# Altium schematic sheet control_module.SchDoc
size A4
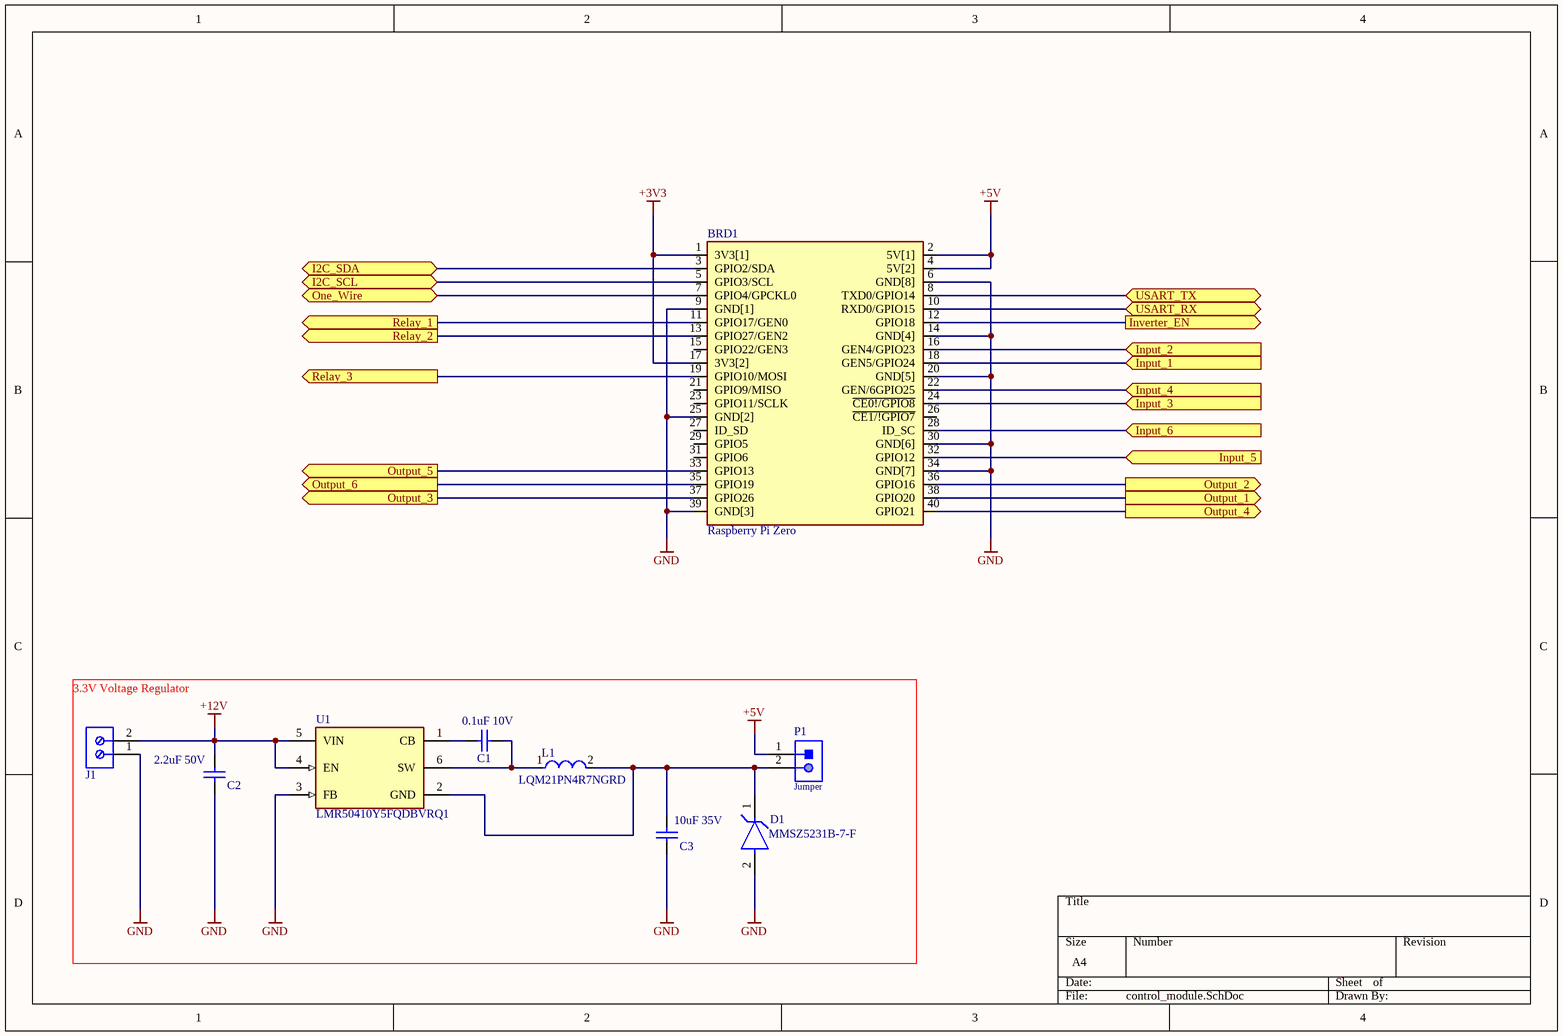
[diagram p0: control_module.SchDoc]

## Parts
BRD1  Raspberry Pi Zero  [RASPBERRY_PI_ZERO]
C1  0.1uF 10V  [CAPC2013X88X50ML20T25]
C2  2.2uF 50V  [CAPC2013X88X50ML20T25]
C3  10uF 35V  [CAPC2013X88X50ML20T25]
D1  MMSZ5231B-7-F  [FP-SOD123-MFG]
J1  282836-2  [TECO-282836-2_V]  (value not drawn)
L1  LQM21PN4R7NGRD  [FP-LQM21PH_G0-IPC_B]
P1  Jumper  [61300211121]
U1  LMR50410Y5FQDBVRQ1  [FP-DBV0006A-IPC_C]

## Ports
I2C_SCL (bidir), I2C_SDA (bidir), Input_1 (in), Input_2 (in), Input_3 (in), Input_4 (in), Input_5 (in), Input_6 (in), Inverter_EN (out), One_Wire (bidir), Output_1 (out), Output_2 (out), Output_3 (out), Output_4 (out), Output_5 (out), Output_6 (out), Relay_1 (out), Relay_2 (out), Relay_3 (out), USART_RX (bidir), USART_TX (bidir)

## Nets
+3V3: BRD1.1(3V3[1]) BRD1.17(3V3[2])
+5V: BRD1.2(5V[1]) BRD1.4(5V[2]) P1.1
+12V: C2.2 J1.2 U1.4(EN) U1.5(VIN)
GND: BRD1.6(GND[8]) BRD1.9(GND[1]) BRD1.14(GND[4]) BRD1.20(GND[5]) BRD1.25(GND[2]) BRD1.30(GND[6]) BRD1.34(GND[7]) BRD1.39(GND[3]) C2.1 C3.2 D1.2(A) J1.1 U1.3(FB)
I2C_SCL: BRD1.5(GPIO3/SCL) ; port I2C_SCL
I2C_SDA: BRD1.3(GPIO2/SDA) ; port I2C_SDA
Input_1: BRD1.18(GEN5/GPIO24) ; port Input_1
Input_2: BRD1.16(GEN4/GPIO23) ; port Input_2
Input_3: BRD1.24(~{CE0!/GPIO8}) ; port Input_3
Input_4: BRD1.22(GEN/6GPIO25) ; port Input_4
Input_5: BRD1.32(GPIO12) ; port Input_5
Input_6: BRD1.28(ID_SC) ; port Input_6
Inverter_EN: BRD1.12(GPIO18) ; port Inverter_EN
One_Wire: BRD1.7(GPIO4/GPCKL0) ; port One_Wire
Output_1: BRD1.38(GPIO20) ; port Output_1
Output_2: BRD1.36(GPIO16) ; port Output_2
Output_3: BRD1.37(GPIO26) ; port Output_3
Output_4: BRD1.40(GPIO21) ; port Output_4
Output_5: BRD1.33(GPIO13) ; port Output_5
Output_6: BRD1.35(GPIO19) ; port Output_6
Relay_1: BRD1.11(GPIO17/GEN0) ; port Relay_1
Relay_2: BRD1.13(GPIO27/GEN2) ; port Relay_2
Relay_3: BRD1.19(GPIO10/MOSI) ; port Relay_3
USART_RX: BRD1.10(RXD0/GPIO15) ; port USART_RX
USART_TX: BRD1.8(TXD0/GPIO14) ; port USART_TX
NetC1_1: C1.1 L1.1 U1.6(SW)
NetC1_2: C1.2 U1.1(CB)
NetC3_1: C3.1 D1.1(C) L1.2 P1.2 U1.2(GND)

Not connected (* = marked no-connect by the designer): BRD1 15(GPIO22/GEN3) 21(GPIO9/MISO) 23(GPIO11/SCLK) 26(~{CE1/!GPIO7}) 27(ID_SD) 29(GPIO5) 31(GPIO6)

## Notes on the sheet
- 3.3V Voltage Regulator

## Library data of the parts
BRD1 = MCU_raspberryPi_zero: Raspberry Pi Zero with Header; MP: ADA3708; Availability: Unavailable; Package: None; MF: Raspberry Pi; Value: *; Price: None; SnapEDA_Link: https://www.snapeda.com/parts/ADA3708/Raspberry%20Pi/view-part/2770118/?ref=snap
C1-C3 = Cap_0805: Capacitor
D1 = CMP-12792-000005-1: DIODE ZENER 5.1V 500MW SOD123; Manufacturer: Diodes; Standoff Height: 0mm; Max Zener Voltage: 5.36V; Max Reverse Leakage Current: 5uA; Max Junction Temp: +150°C; Power Dissipation: 370mW; Zener Impedance: 17Ω; Temperature: -65°C to +150°C; RoHS: TRUE; ComponentLink2Description: Datasheet; Octopart: https://octopart.com/mmsz5231b-7-f-diodes+inc.-55400050; Height: 1.45mm; ComponentLink2URL: https://www.diodes.com/assets/Datasheets/ds18010.pdf; Footprint Url: https://www.diodes.com/assets/Package-Files/SOD123.pdf; Device Class L2: Diodes; Nom Zener Voltage: 5.1V; Temperature Range Low: -65°C; Mouser Description: Zener Diodes 5.1V 500mW; Manufacturer Part Number: MMSZ5231B-7-F; Digikey Description: DIODE ZENER 5.1V 500MW SOD123; Device Class L1: Discrete Semiconductors; Device Class L3: Zener Diodes; Lead Free: Yes; Category: Diode; Automotive: No; Package: SOD123; Temperature Range High: +150°C
J1 = CMP-1684-00017-1: Female Header, Pitch 5 mm, 1 x 2 Position, Height 10 mm, Tail Length 3.5 mm, Rohs, Bulk; Manufacturer: TE Connectivity; Wire Gauge: 16-30AWG; Product Training Modules: Wire-to-BoardEurostyleTerminalBlocks; Clamp Material - Plating: Brass-NickelPlated; Voltage: 300V; Mating Orientation: HorizontalwithBoard; Current: 13.5A; Pitch: 0.197"(5.00mm); Screw Thread: M3; 3D Model: 282836-2.pdf; Other Names: 5ULV-02B / A98076; Dynamic Catalog: BuchananSeries; Number of Levels: 1; Torque - Screw: 0.68Nm(6Lb-In); Featured Product: EurostyleTerminalBlockConnectors; Positions Per Level: 2; Wire Termination: Screw-RisingCageClamp; Datasheet URL: http://www.te.com.cn/commerce/DocumentDelivery/DDEController?Action=showdoc&DocId=Catalog+Section%7F1308389_EUROSTYLE_TERMINAL_BLOCKS%7F0607%7Fpdf%7FEnglish%7FENG_CS_1308389_EUROSTYLE_TERMINAL_BLOCKS_0607.pdf%7F282836-2; Color: Green; Family: TerminalBlocks-WiretoBoard; RoHS Information: 282836-2StatementofCompliance; Standard Package: 300; Contact Material - Plating: Brass-TinPlated; Manufacturer URL: http://www.te.com; Housing Material: Polyamide(PA66),Nylon6/6; Features: Interlocking(Side); Package Description: Female Header, Pitch 5 mm, 1 x 2 Position, Height 10 mm, Tail Length 3.5 mm; Mounting Type: ThroughHole; Package Reference: THD; Packaging: Bulk; Series: Buchanan; Category: Connectors,Interconnects; Screw Material - Plating: Brass-NickelPlated
L1 = CMP-06042-016903-1: Multilayer Type Inductor for Power Lines, 0805 (2012), 4.7μH, 30%, 0.288Ω, 0.8A; Test Frequency: 1MHz; Shielding: Shielded; DC Resistance (DCR): 288mR; Inductance: 4.7uH; Core Material: Ferrite; Current Rating: 800mA; Self Resonant Frequency: 30MHz; Min Operating Temperature: -55°C; Length: 0.079inch; Termination: SMD/SMT; Tolerance: 30%; Max Operating Temperature: 125°C; Case Code (Metric): 2012; Height - Seated (Max): 0.039inch; Series: LQM21PN_GR; Width: 1.25mm; Depth: 1.4mm; Package Quantity: 4000; Case/Package: 0805; Max DC Current: 800mA; Case Code (Imperial): 0805; Height: 0.9mm; Mount: Surface Mount; Military Standard: Not; DC Current: 800mA; Packaging: Tape and Reel; RoHS Compliant: Yes; Radiation Hardening: No; Lead Free: Lead Free
P1 = CMP-1712-00002-4: THT Vertical Pin Header WR-PHD, Pitch 2.54 mm, Single Row, 2 pins; Manufacturer: Wurth Elektronik; Rated Current: 3A; Gender: Male; Withstanding Voltage: 500VAC; Working Voltage: 250VAC; Pitch: 2.54mm; Contact Resistance: 20mOhm; Pin Number: 2; Mounting Technology: THT; Orientation: Vertical; Operating Temperature: -40to105degC; Packaging: Bag; Publisher: WurthElektronik; Datasheet URL: https://katalog.we-online.de/em/datasheet/6130xx11121.pdf; Manufacturer URL: http://www.we-online.de; Row Number: Single; Package Reference: 61300211121; Part Number: 61300211121
U1 = CMP-04918-000667-1: AUTOMOTIVE QUALIFIED SIMPLE SWIT